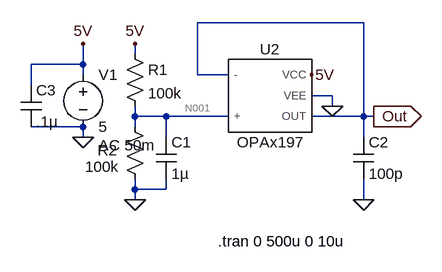
[diagram p0: schematic RefAmp197.asc]
RefAmp197.asc, the LTspice schematic file:
Version 4
SHEET 1 880 680
WIRE 432 64 176 64
WIRE 80 112 80 96
WIRE 0 128 0 96
WIRE 0 128 -80 128
WIRE 0 144 0 128
WIRE 176 144 176 64
WIRE 224 144 176 144
WIRE -80 160 -80 128
WIRE 384 176 352 176
WIRE 384 192 384 176
WIRE 80 208 80 192
WIRE 128 208 80 208
WIRE 224 208 128 208
WIRE 432 208 432 64
WIRE 432 208 352 208
WIRE 448 208 432 208
WIRE 0 224 -80 224
WIRE 80 224 80 208
WIRE 0 240 0 224
WIRE 128 240 128 208
WIRE 432 240 432 208
WIRE 80 320 80 304
WIRE 128 320 128 304
WIRE 128 320 80 320
WIRE 80 336 80 320
WIRE 432 336 432 304
FLAG 80 336 0
FLAG 0 240 0
FLAG 0 96 5V
FLAG 80 96 5V
FLAG 352 144 5V
FLAG 432 336 0
FLAG 384 192 0
FLAG 448 208 Out
IOPIN 448 208 Out
SYMBOL voltage 0 128 R0
WINDOW 123 24 124 Left 2
WINDOW 39 0 0 Left 0
SYMATTR Value2 AC 50m
SYMATTR InstName V1
SYMATTR Value 5
SYMBOL res 64 96 R0
SYMATTR InstName R1
SYMATTR Value 100k
SYMBOL res 64 208 R0
WINDOW 0 -42 52 Left 2
WINDOW 3 -61 77 Left 2
SYMATTR InstName R2
SYMATTR Value 100k
SYMBOL cap 112 240 R0
SYMATTR InstName C1
SYMATTR Value 1µ
SYMBOL cap 416 240 R0
SYMATTR InstName C2
SYMATTR Value 100p
SYMBOL cap -96 160 R0
SYMATTR InstName C3
SYMATTR Value .1µ
SYMBOL OPAx197 288 176 R0
SYMATTR InstName U2
TEXT 208 400 Left 2 !.tran 0 500u 0 10u

The netlist it stands for:
* RefAmp197.asc
V1 5V 0 5 AC 50m
R1 5V N001 100k
R2 N001 0 100k
C1 N001 0 1µ
C2 Out 0 100p
C3 5V 0 .1µ
XU2 N001 Out 5V 0 Out OPAx197  ; pins + - VCC VEE OUT
.tran 0 500u 0 10u
.lib C:\Users\bismi\OneDrive\Documents\LTspice\SPICEV2\OPAx197.LIB
.backanno
.end

* Results of the author's LTspice run, read from the files saved beside the schematic
* Operating Point, zero values left out:
*   V(5v) = 5 V
*   V(n001) = 2.5 V
*   V(out) = 2.5 V
*   I(R1) = 25 µA
*   I(R2) = 25 µA
*   I(V1) = -1.025 mA
*   Ix(u2:IN+) = 4.741 pA
*   Ix(u2:IN-) = 3.211 pA
*   Ix(u2:VCC) = 1 mA
*   Ix(u2:VEE) = -1 mA
*   Ix(u2:OUT) = -3.211 pA